# EAGLE design pcb_v2.2 (EAGLE 9.1.1)
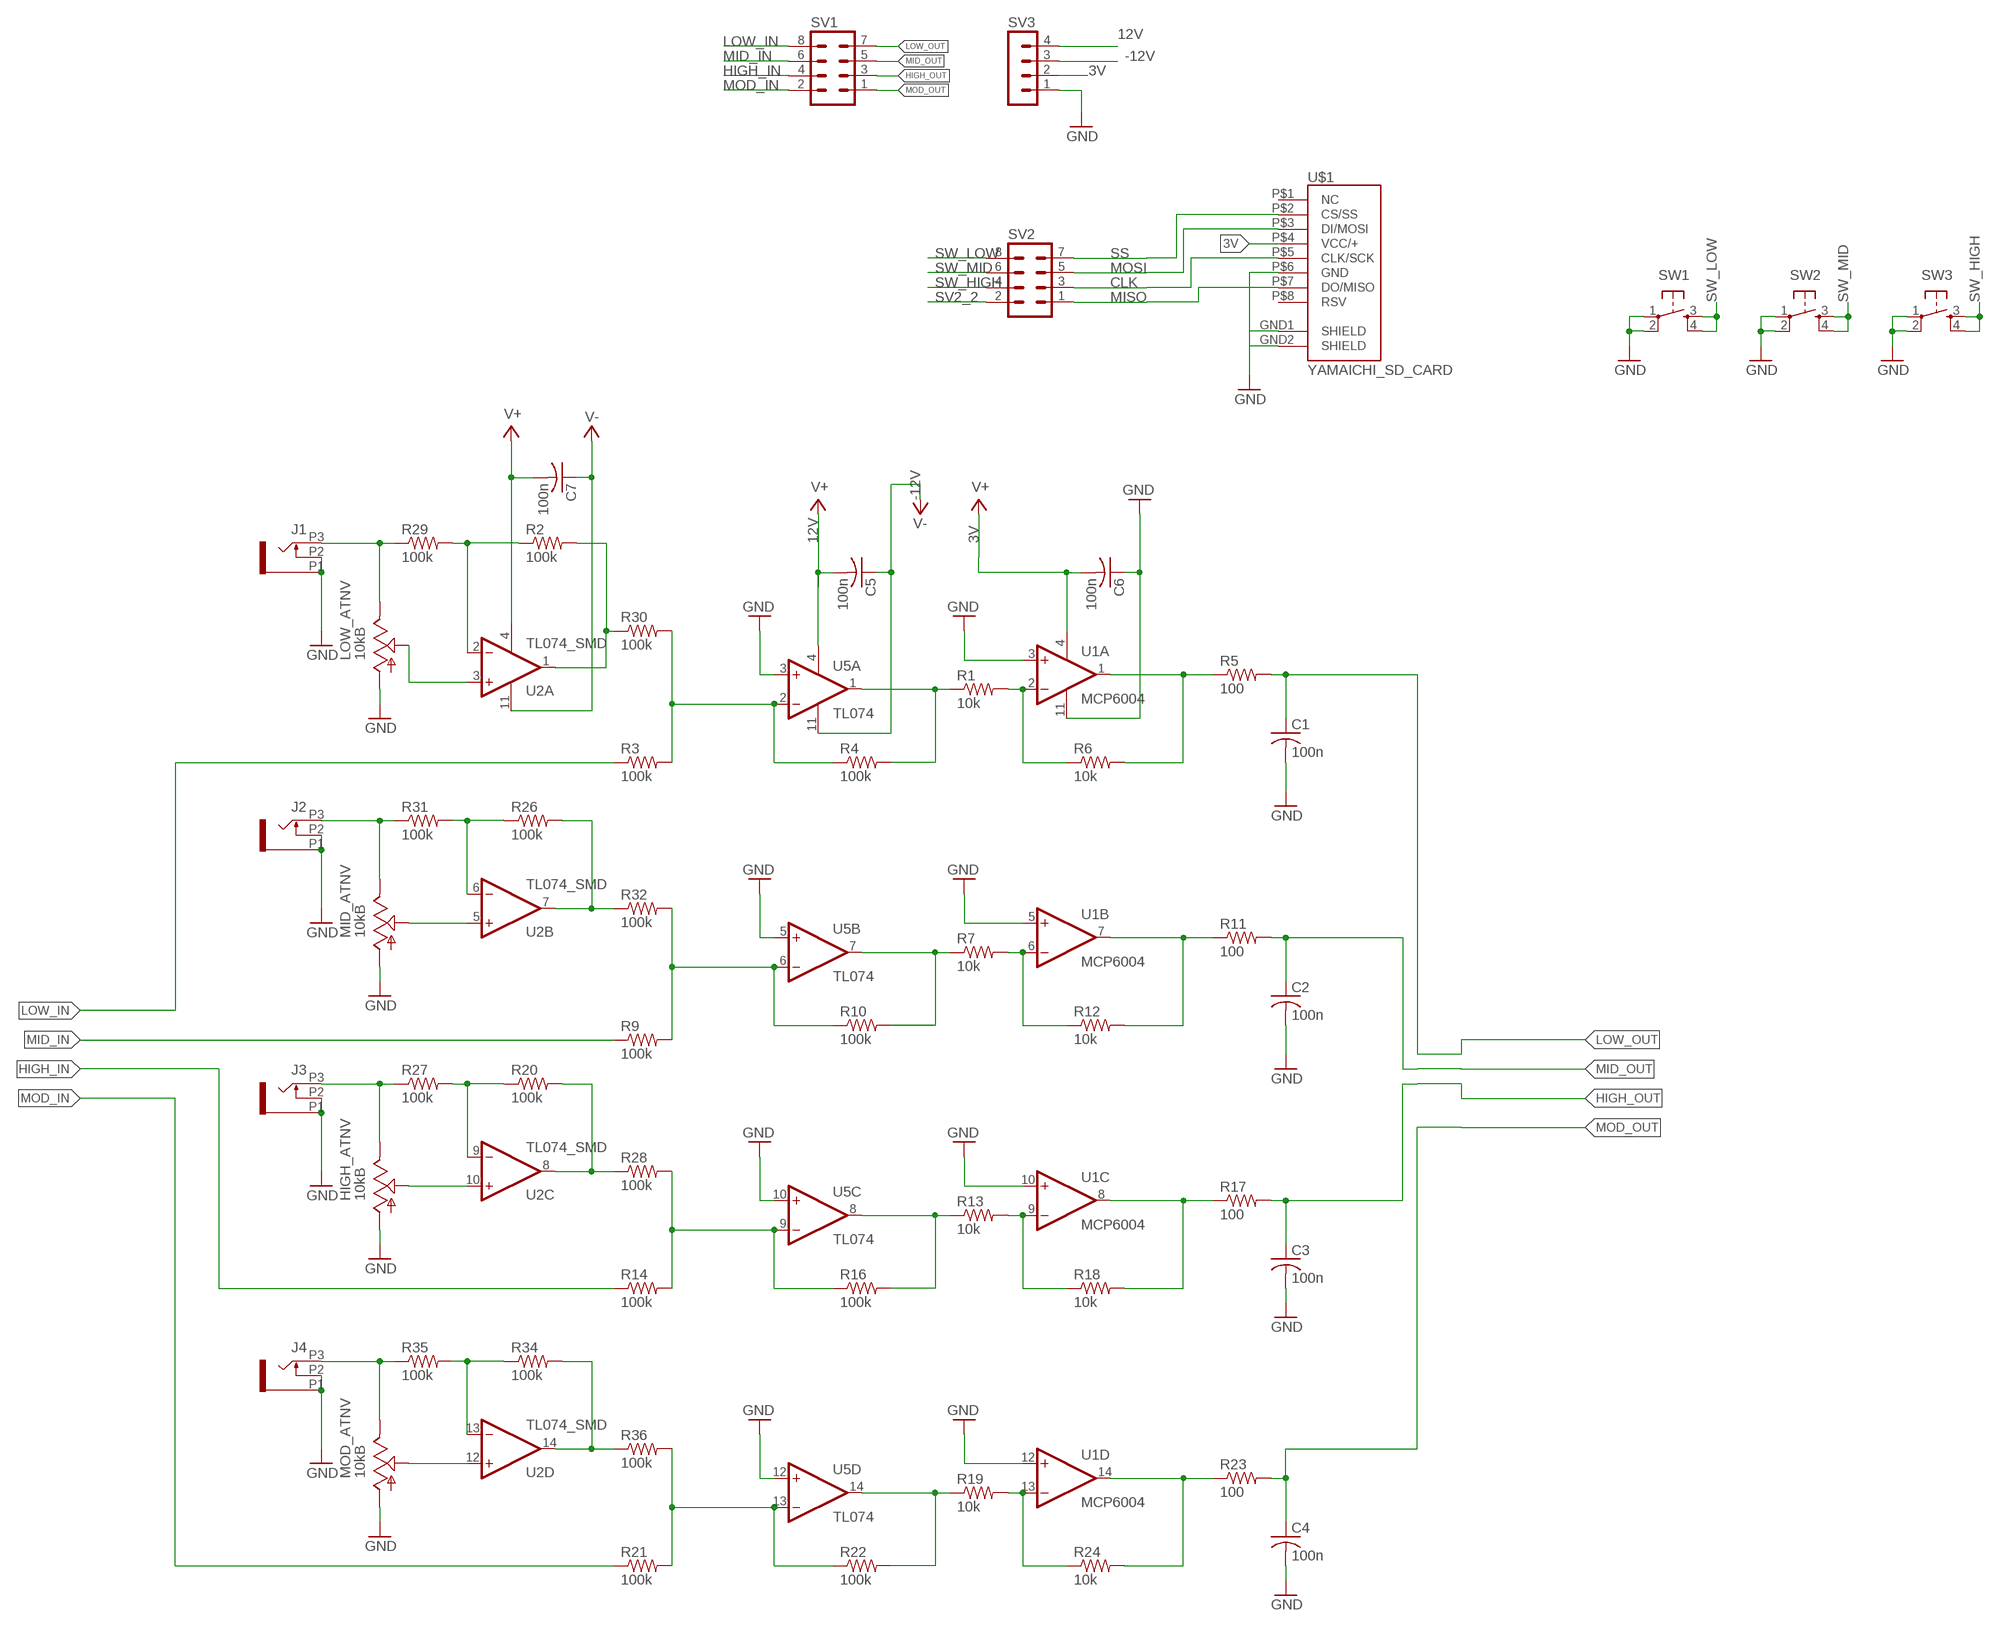
[diagram p0: schematic, sheet 1]

## Parts
C1  100n  C-USC0603  [C0603]
C2  100n  C-USC0603  [C0603]
C3  100n  C-USC0603  [C0603]
C4  100n  C-USC0603  [C0603]
C5  100n  C-USC0603  [C0603]
C6  100n  C-USC0603  [C0603]
C7  100n  C-USC0603  [C0603]
HIGH_ATNV  10kB  POT_USVERTICAL  [ALPS_POT_VERTICAL]
J1  PJ301_THONKICONN6  [WQP_PJ_301M6]
J2  PJ301_THONKICONN6  [WQP_PJ_301M6]
J3  PJ301_THONKICONN6  [WQP_PJ_301M6]
J4  PJ301_THONKICONN6  [WQP_PJ_301M6]
LOW_ATNV  10kB  POT_USVERTICAL  [ALPS_POT_VERTICAL]
MID_ATNV  10kB  POT_USVERTICAL  [ALPS_POT_VERTICAL]
MOD_ATNV  10kB  POT_USVERTICAL  [ALPS_POT_VERTICAL]
R1  10k  R-US_R0603  [R0603]
R2  100k  R-US_R0603  [R0603]
R3  100k  R-US_R0603  [R0603]
R4  100k  R-US_R0603  [R0603]
R5  100  R-US_R0603  [R0603]
R6  10k  R-US_R0603  [R0603]
R7  10k  R-US_R0603  [R0603]
R9  100k  R-US_R0603  [R0603]
R10  100k  R-US_R0603  [R0603]
R11  100  R-US_R0603  [R0603]
R12  10k  R-US_R0603  [R0603]
R13  10k  R-US_R0603  [R0603]
R14  100k  R-US_R0603  [R0603]
R16  100k  R-US_R0603  [R0603]
R17  100  R-US_R0603  [R0603]
R18  10k  R-US_R0603  [R0603]
R19  10k  R-US_R0603  [R0603]
R20  100k  R-US_R0603  [R0603]
R21  100k  R-US_R0603  [R0603]
R22  100k  R-US_R0603  [R0603]
R23  100  R-US_R0603  [R0603]
R24  10k  R-US_R0603  [R0603]
R26  100k  R-US_R0603  [R0603]
R27  100k  R-US_R0603  [R0603]
R28  100k  R-US_R0603  [R0603]
R29  100k  R-US_R0603  [R0603]
R30  100k  R-US_R0603  [R0603]
R31  100k  R-US_R0603  [R0603]
R32  100k  R-US_R0603  [R0603]
R34  100k  R-US_R0603  [R0603]
R35  100k  R-US_R0603  [R0603]
R36  100k  R-US_R0603  [R0603]
SV1  MA04-2  [MA04-2]
SV2  MA04-2  [MA04-2]
SV3  MA04-1  [MA04-1]
SW1  TAC_SWITCHPTH  [TACTILE-PTH]
SW2  TAC_SWITCHPTH  [TACTILE-PTH]
SW3  TAC_SWITCHPTH  [TACTILE-PTH]
U1  MCP6004  MCP6004_SMD  [SO14]
U2  TL074_SMD  [SO14]
U5  TL074  TL074_SMD  [SO14]
U$1  YAMAICHI_SD_CARD  [YAMAICHI_MICROSD_VERTICAL]

## Nets
3V: C6.2 SV3.2 U1.4(P:V+) ; supply symbol labelled V+
12V: C5.2 SV3.4 U5.4(P:V+) ; supply symbol labelled V+
-12V: C5.1 SV3.3 U5.11(P:V-) ; supply symbol labelled V-
CLK: SV2.3 U$1.P$5(CLK/SCK)
GND: C1.2 C2.2 C3.2 C4.2 C6.1 HIGH_ATNV.P$3(A) J1.P1 J1.P2 J2.P1 J2.P2 J3.P1 J3.P2 J4.P1 J4.P2 LOW_ATNV.P$3(A) MID_ATNV.P$3(A) MOD_ATNV.P$3(A) SV3.1 SW1.1 SW1.2 SW2.1 SW2.2 SW3.1 SW3.2 U1.3(A:+IN) U1.5(B:+IN) U1.10(C:+IN) U1.11(P:V-) U1.12(D:+IN) U5.3(A:+IN) U5.5(B:+IN) U5.10(C:+IN) U5.12(D:+IN) U$1.GND1(SHIELD) U$1.GND2(SHIELD) U$1.P$6(GND)
HIGH_IN: R14.1 SV1.4
HIGH_OUT: C3.1 R17.2 SV1.3
LOW_IN: R3.1 SV1.8
LOW_OUT: C1.1 R5.2 SV1.7
MID_IN: R9.1 SV1.6
MID_OUT: C2.1 R11.2 SV1.5
MISO: SV2.1 U$1.P$7(DO/MISO)
MOD_IN: R21.1 SV1.2
MOD_OUT: C4.1 R23.2 SV1.1
MOSI: SV2.5 U$1.P$3(DI/MOSI)
N$1: R2.1 R29.2 U2.2(A:-IN)
N$2: R26.1 R31.2 U2.6(B:-IN)
N$3: R2.2 R30.1 U2.1(A:OUT)
N$4: R1.1 R4.2 U5.1(A:OUT)
N$5: R5.1 R6.2 U1.1(A:OUT)
N$6: R20.1 R27.2 U2.9(C:-IN)
N$7: HIGH_ATNV.P$2(S) U2.10(C:+IN)
N$8: R9.2 R10.1 R32.2 U5.6(B:-IN)
N$9: R7.1 R10.2 U5.7(B:OUT)
N$10: LOW_ATNV.P$2(S) U2.3(A:+IN)
N$11: MID_ATNV.P$2(S) U2.5(B:+IN)
N$12: HIGH_ATNV.P$1(E) J3.P3 R27.1
N$13: R20.2 R28.1 U2.8(C:OUT)
N$14: R13.1 R16.2 U5.8(C:OUT)
N$15: R34.1 R35.2 U2.13(D:-IN)
N$16: U$1.P$4(VCC/+)
N$19: R19.1 R22.2 U5.14(D:OUT)
N$20: R1.2 R6.1 U1.2(A:-IN)
N$22: R7.2 R12.1 U1.6(B:-IN)
N$23: R13.2 R18.1 U1.9(C:-IN)
N$24: R19.2 R24.1 U1.13(D:-IN)
N$26: R11.1 R12.2 U1.7(B:OUT)
N$27: R17.1 R18.2 U1.8(C:OUT)
N$28: R23.1 R24.2 U1.14(D:OUT)
N$30: J1.P3 LOW_ATNV.P$1(E) R29.1
N$31: R3.2 R4.1 R30.2 U5.2(A:-IN)
N$32: J2.P3 MID_ATNV.P$1(E) R31.1
N$33: R26.2 R32.1 U2.7(B:OUT)
N$34: MOD_ATNV.P$2(S) U2.12(D:+IN)
N$35: J4.P3 MOD_ATNV.P$1(E) R35.1
N$36: R34.2 R36.1 U2.14(D:OUT)
N$37: R14.2 R16.1 R28.2 U5.9(C:-IN)
N$38: R21.2 R22.1 R36.2 U5.13(D:-IN)
SS: SV2.7 U$1.P$2(CS/SS)
SV2_2: SV2.2
SW_HIGH: SV2.4 SW3.3 SW3.4
SW_LOW: SV2.8 SW1.3 SW1.4
SW_MID: SV2.6 SW2.3 SW2.4
V+: C7.2 U2.4(P:V+)
V-: C7.1 U2.11(P:V-)
Unconnected: U$1.P$1(NC) U$1.P$8(RSV)

## Library data of the parts
C1-C7 = rcl:C-US: CAPACITOR, American symbol; SPICEPREFIX: C
HIGH_ATNV LOW_ATNV MID_ATNV MOD_ATNV = og-pots:POT_US
J1-J4 = og-pj301:PJ301_THONKICONN; SPICEPREFIX: J
R1-R7 R9-R14 R16-R24 R26-R32 R34-R36 = rcl:R-US_: RESISTOR, American symbol; SPICEPREFIX: R
SV1 SV2 = con-lstb:MA04-2: PIN HEADER; OC_FARNELL: unknown; OC_NEWARK: unknown
SV3 = con-lstb:MA04-1: PIN HEADER; OC_FARNELL: unknown; OC_NEWARK: unknown
SW1-SW3 = SparkFun:TAC_SWITCH: Momentary Switch Button commonly used for reset or general input. Spark Fun Electronics SKU : COM-00097
U1 = MusicThingModular:MCP6004: Generic Quad Op Amp
U2 U5 = MusicThingModular:TL074: Generic Quad Op Amp
U$1 = MusicThingModular:YAMAICHI_SD_CARD: Vertical SD Card Holder

## Board
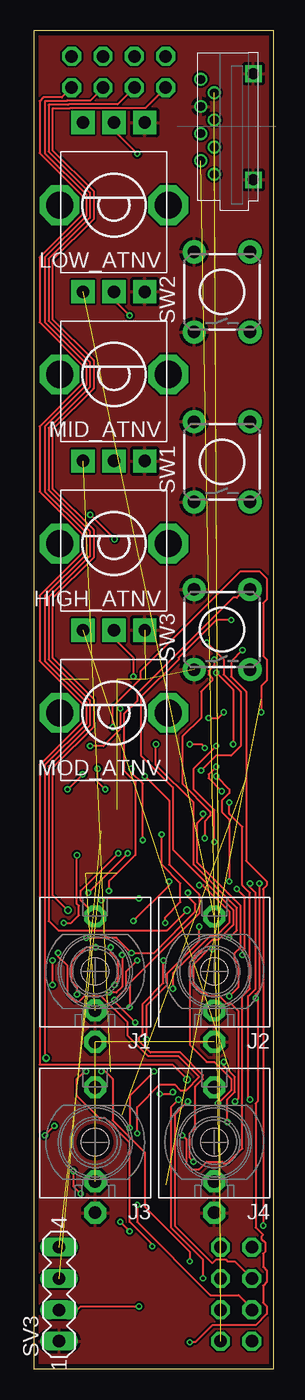
[diagram p1: board, top side]
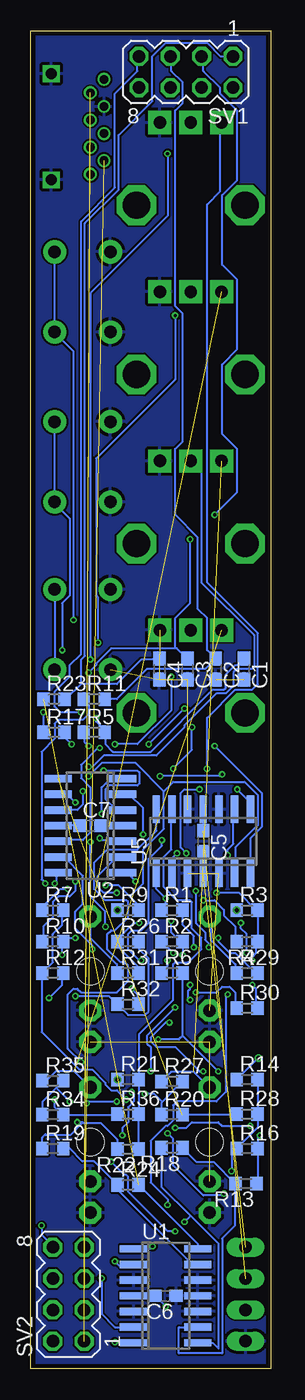
[diagram p2: board, bottom side, seen from below]

Size 19.43 x 108.43 mm. Coordinates in mm from the lower left corner, seen from the top.
Outline: 0,0 19.43,0 19.43,108.43 0,108.43 0,0
Copper layers (1*16): Top 0.035559375mm / dielectric 1.6mm / Bottom 0.035559375mm
Design rules "oshpark-2layer": minimum track width 6mil, minimum drill 10mil, track to track 6mil, track to pad 6mil, pad to pad 6mil, via to via 6mil, smd to smd 6mil, copper to edge 15mil, drill to drill 6mil, minimum pad ring 5mil, minimum via ring 5mil, stop-mask expansion 2.5mil, vias tented up to drill 0mil, thermal gap 10mil

### Footprints (pad centres in the part's own frame; a part is rotated, then mirrored left to right if it is on the bottom)
C0603 = smd 1.1 x 1: 1 -0.85,0; 2 0.85,0
ALPS_POT_VERTICAL = drill 1 pad 1.88 square: P$1 -2.5,6.7; P$2 0,6.7; P$3 2.5,6.7 | drill 2.2 pad 3.175 octagon: P$4 -4.4,0; P$5 4.4,0
WQP_PJ_301M6 = drill 1.016 pad 1.778 octagon: P1 0,-5.715; P2 0,-3.175; P3 0,4.445 | hole 2.2: 0,0
R0603 = smd 1 x 1.1: 1 -0.85,0; 2 0.85,0
MA04-2 = drill 1.016 octagon: 1 -3.81,-1.27; 2 -3.81,1.27; 3 -1.27,-1.27; 4 -1.27,1.27; 5 1.27,-1.27; 6 1.27,1.27; 7 3.81,-1.27; 8 3.81,1.27
MA04-1 = drill 1.016 long: 1 -3.81,0; 2 -1.27,0; 3 1.27,0; 4 3.81,0
TACTILE-PTH = drill 1.016 pad 1.88: 1 -3.251,2.261; 2 3.251,2.261; 3 -3.251,-2.261; 4 3.251,-2.261
SO14 = smd 0.6 x 2.2: 1 -3.81,-2.6; 2 -2.54,-2.6; 3 -1.27,-2.6; 4 0,-2.6; 5 1.27,-2.6; 6 2.54,-2.6; 7 3.81,-2.6; 8 3.81,2.6; 9 2.54,2.6; 10 1.27,2.6; 11 0,2.6; 12 -1.27,2.6; 13 -2.54,2.6; 14 -3.81,2.6
YAMAICHI_MICROSD_VERTICAL = drill 0.9 square: GND1 -4.3,-3.17; GND2 4.3,-3.17 | drill 0.7: P$1 -3.85,0; P$2 -2.75,1.1; P$3 -1.65,0; P$4 -0.55,1.1; P$5 0.55,0; P$6 1.65,1.1; P$7 2.75,0; P$8 3.85,1.1

### Placement (x,y rotation side)
C1  2.16,56.71 270 bottom
C2  4.45,56.71 270 bottom
C3  6.73,56.71 270 bottom
C4  9.02,56.71 270 bottom
C5  5.46,42.74 270 bottom
C6  8.51,5.91 180 bottom
C7  14.61,44.01 0 bottom
HIGH_ATNV  6.48,66.87 0 top
J1  4.95,32.19 0 top
J2  14.61,32.19 0 top
J3  4.95,18.35 0 top
J4  14.61,18.35 0 top
LOW_ATNV  6.48,94.3 0 top
MID_ATNV  6.48,80.58 0 top
MOD_ATNV  6.48,53.15 0 top
R1  8,37.15 0 bottom
R2  8,34.61 0 bottom
R3  1.91,37.15 0 bottom
R4  1.91,34.61 180 bottom
R5  14.3,51.57 0 bottom
R6  8,32.07 0 bottom
R7  17.65,37.15 0 bottom
R9  11.56,37.15 0 bottom
R10  17.65,34.61 0 bottom
R11  14.3,54.27 0 bottom
R12  17.65,32.07 0 bottom
R13  2.01,15 180 bottom
R14  1.91,23.43 0 bottom
R16  1.91,17.84 0 bottom
R17  17.55,51.57 0 bottom
R18  8,17.89 180 bottom
R19  17.65,17.84 0 bottom
R20  8,20.59 0 bottom
R21  11.56,23.43 0 bottom
R22  11.56,17.79 180 bottom
R23  17.55,54.27 0 bottom
R24  11.56,14.9 0 bottom
R26  11.56,34.61 0 bottom
R27  8,23.28 0 bottom
R28  1.91,20.64 0 bottom
R29  1.91,32.07 0 bottom
R30  1.91,29.22 0 bottom
R31  11.56,32.07 0 bottom
R32  11.56,29.53 0 bottom
R34  17.65,20.59 0 bottom
R35  17.65,23.33 0 bottom
R36  11.56,20.64 0 bottom
SV1  6.86,105.09 180 bottom
SV2  16.38,6.03 90 bottom
SV3  2.03,6.03 90 top
SW1  15.24,73.49 90 top
SW2  15.24,87.26 90 top
SW3  15.24,59.91 90 top
U1  8.51,5.91 270 bottom
U2  14.61,44.01 90 bottom
U5  5.46,42.74 0 bottom
U$1  14.61,100.65 90 top

### Tracks (layer width: path | path; a pad name or v marks a point on that pad's centre or on a via)
3V  (via drill 0.25)
  Top 0.152: v8.51,5.04 3.79,5.04 3.48,4.74 2.11,4.74 SV3.2
  Bottom 0.152: U1.4 11.1,5.96 9.42,5.96 C6.2 9.27,5.8 v8.51,5.04
12V  (1 unrouted)
  Bottom 0.152: C5.2 5.46,41.77 5.46,40.25 U5.4
-12V  (1 unrouted)
  Bottom 0.152: C5.1 5.46,43.6 5.46,45.28 U5.11
CLK  (1 unrouted)
GND  (9 unrouted)
  pour Bottom: 0.38,108.52 19.68,108.52 19.68,-0.7 0.38,-0.7
  pour Top: -0.64,109.03 20.19,109.03 20.19,-0.7 19.68,-1.21 0.38,-1.21 -0.64,-0.19
HIGH_IN  (via drill 0.35)
  Top 0.152: SV1.4 4.54,102.78 2.69,102.78 2.64,102.73 0.89,102.73 0.89,98.51 4.22,95.18 4.22,93.41 0.89,90.08 0.89,84.8 4.22,81.47 4.22,79.69 0.89,76.37 0.89,71.08 4.22,67.75 4.22,65.98 0.89,62.65 0.89,57.37 4.22,54.04 4.22,52.26 0.97,49.01 0.89,48.93 0.89,26.53 | 0.89,26.53 | 0.89,26.53 0.89,25.28 v0.99,25.18
  Bottom 0.152: v0.99,25.18 2.74,23.43 R14.1
HIGH_OUT  (via drill 0.25)
  Top 0.152: v16.13,50.61 16.13,55.03 v14.76,56.4 | v6.53,67.22 v4.55,69.2
  Bottom 0.152: v16.13,50.61 16.59,51.07 16.59,51.52 R17.2 | v14.76,56.4 14.15,57.01 14.15,57.16 12.93,58.38 7.75,58.38 | 7.75,58.38 7.6,58.38 6.83,57.62 C3.1 | v4.55,69.2 2.72,71.03 2.72,74.54 3.94,75.76 3.94,81.39 2.72,82.61 2.72,88.25 3.94,89.47 3.94,95.11 2.72,96.33 2.72,101.97 4.09,103.34 4.09,103.8 5.46,105.17 5.46,106.24 SV1.3 | v6.53,67.22 6.53,62.04 7.75,60.82 7.75,58.38
LOW_IN  (via drill 0.35)
  Top 0.152: SV1.8 9.01,102.17 2.94,102.17 2.9,102.12 1.5,102.12 1.5,98.77 4.83,95.44 4.83,93.16 1.5,89.83 1.5,85.05 4.83,81.72 4.83,79.44 1.5,76.11 1.5,71.33 4.83,68.01 4.83,65.73 1.5,62.4 1.5,57.62 4.83,54.29 4.83,52.01 1.7,48.88 1.5,48.68 1.5,38.4 R3.1
  other vias: 2.75,37.15
LOW_OUT  (via drill 0.25)
  Top 0.152: v15.37,53.2 14.91,52.74 v14.15,52.74
  Bottom 0.152: C1.1 2.26,57.47 2.72,57.01 2.87,57.01 3.63,56.25 3.63,55.18 3.79,55.03 4.7,55.03 9.73,50 12.78,50 13.39,50.61 13.39,51.52 R5.2 13.39,51.68 14.15,52.44 v14.15,52.74 | v15.37,53.2 17.04,53.2 17.5,53.66 17.5,54.88 16.28,56.1 16.28,57.01 15.37,57.92 15.37,92.98 12.62,95.72 12.62,103.34 10.79,105.17 10.79,106.24 SV1.7
MID_IN  (via drill 0.35)
  Top 0.152: SV1.6 6.78,102.47 2.82,102.47 2.77,102.43 1.19,102.43 1.19,98.64 4.52,95.31 4.52,93.28 1.19,89.95 1.19,84.92 4.52,81.59 4.52,79.57 1.19,76.24 1.19,71.21 4.52,67.88 4.52,65.85 1.19,62.52 1.19,57.49 4.52,54.16 4.52,52.14 1.19,48.81 1.19,36.28 1.96,35.52 10.78,35.52 R9.1
  other vias: 12.41,37.15
MID_OUT
  Bottom 0.152: R11.2 13.39,54.27 12.47,54.27 10.03,56.71 5.31,56.71 4.55,57.47 C2.1 4.55,57.62 5.16,58.23 5.16,60.82 5.92,61.58 5.92,67.37 7.75,69.2 7.75,74.54 7.14,75.15 7.14,85.51 7.75,86.12 7.75,101.97 7.14,102.58 7.14,104.25 8.05,105.17 8.05,106.24 SV1.5
MISO  (1 unrouted)
MOD_IN  (via drill 0.35)
  Top 0.152: SV1.2 2.26,103.04 0.76,103.04 0.46,102.73 0.46,98.51 3.91,95.06 3.91,93.54 0.46,90.08 0.46,84.8 3.91,81.34 3.91,79.82 0.46,76.36 0.46,71.08 3.91,67.63 3.91,66.1 0.46,62.65 0.46,57.37 3.91,53.91 3.91,52.39 0.46,48.93 0.46,24.65 11.19,24.65 R21.1
  other vias: 12.41,23.43
MOD_OUT
  Bottom 0.152: 15.37,55.49 16.59,54.27 R23.2 | 15.37,55.49 12.47,55.49 10.49,57.47 9.12,57.47 C4.1 | 15.37,55.49 15.37,57.47 15.06,57.77 15.06,92.82 12.32,95.57 12.32,99.99 9.58,102.73 9.58,106.39 8.51,107.45 5.16,107.45 4.09,106.39 3.17,106.39 SV1.1
MOSI  (1 unrouted)
N$1  (via drill 0.25)
  Top 0.152: v4.24,34.91 6.68,34.91 v7.9,33.69 9.73,33.69 13.08,37.05 13.08,37.66 12.47,38.27 v12.47,38.57
  Bottom 0.152: v4.24,34.91 4.24,34.61 3.33,33.69 2.87,33.69 1.65,32.47 1.5,32.47 1.19,32.17 R29.2 | v7.9,33.69 8.81,34.61 R2.1 | v12.47,38.57 13.54,38.57 14,39.03 14,39.94 12.47,41.47 U2.2
N$2  (via drill 0.25)
  Top 0.152: v10.34,43.29 10.34,40.86 11.86,39.33 11.86,37.81 10.64,36.59 v10.64,36.13
  Bottom 0.152: 12.32,34.61 12.32,34.15 10.79,32.63 10.79,32.17 R31.2 | 12.32,34.61 R26.1 12.32,34.61 | v10.34,43.29 10.34,45.43 11.4,46.49 11.86,46.49 U2.6 | v10.64,36.13 11.1,36.13 12.32,34.91 12.32,34.61
N$3  (via drill 0.25)
  Top 0.152: v6.07,30.49 6.68,30.49 7.14,30.95 v7.14,33.54 | v10.95,39.48 10.95,39.18 v8.05,36.28
  Bottom 0.152: v6.07,30.49 4.39,30.49 3.94,30.95 3.33,30.95 2.87,30.49 2.87,29.27 R30.1 | v7.14,33.54 7.14,34.61 R2.2 7.29,34.61 8.05,35.37 v8.05,36.28 | v10.95,39.48 11.56,40.09 11.86,40.09 U2.1
N$4  (via drill 0.25)
  Top 0.152: v5.46,37.96 5.61,38.11 v8.51,38.11
  Bottom 0.152: v5.46,37.96 4.55,37.96 3.79,37.2 3.79,36.74 2.87,35.83 2.87,34.61 R4.2 | R1.1 8.81,37.2 8.51,37.5 v8.51,38.11 9.27,38.87 9.27,40.09 U5.1
N$5  (via drill 0.25)
  Top 0.152: v4.24,24.09 4.09,23.94 3.94,23.94 3.48,23.48 3.48,22.11 5.31,20.28 5.77,20.28 7.75,18.3 7.75,11.9 9.58,10.07 v9.58,9.92 | v14.76,50.46 12.93,48.63 12.93,46.95 14.61,45.28 v14.61,42.68 | v13.39,35.83 13.39,34.61 10.79,32.02 10.79,31.1 9.12,29.43 v9.12,26.68
  Bottom 0.152: 7.14,26.99 7.14,32.02 R6.2 | v4.24,24.09 7.14,26.99 | v9.58,9.92 9.73,9.77 11.1,9.77 U1.1 | v14.76,50.46 15.06,50.76 15.06,51.52 R5.1 | v14.61,42.68 14.61,38.27 13.39,37.05 v13.39,35.83 | v9.12,26.68 7.44,26.68 7.14,26.99
N$6  (via drill 0.25)
  Top 0.152: v15.82,45.89 15.82,44.97 16.89,43.9 16.89,39.18 17.5,38.57 17.5,30.8 16.89,30.19 16.89,17.84 15.67,16.62 15.37,16.62 15.21,16.78 14,16.78 13.39,16.17 12.78,16.17 12.32,16.62 12.32,18.61 v12.01,18.91 | v11.25,22.42 11.1,22.26 v10.19,22.26
  Bottom 0.152: R27.2 8.79,21.63 | 8.79,21.63 8.85,21.58 R20.1 | v15.82,45.89 16.43,46.49 17.2,46.49 U2.9 | v12.01,18.91 12.01,19.52 11.56,19.98 11.56,21.2 11.1,21.65 11.1,22.26 v11.25,22.42 | v10.19,22.26 9.42,22.26 8.81,21.65 8.79,21.63
N$7  (via drill 0.25)
  Top 0.152: v15.21,46.8 14.15,47.87 14.15,48.17 v14.76,48.78
  Bottom 0.152: v15.21,46.8 15.21,45.73 15.67,45.28 U2.10 | v14.76,48.78 14.45,48.78 13.54,49.7 9.27,49.7 6.99,51.98 6.99,52.13 4.39,54.72 3.63,54.72 3.02,55.33 3.02,56.4 2.72,56.71 1.5,56.71 1.35,56.86 1.35,59.45 5.61,63.72 5.61,72.71 6.38,73.47 HIGH_ATNV.P$2
N$8  (via drill 0.25)
  Top 0.152: v11.25,30.8 11.25,32.02 14.3,35.06 14.76,35.06 15.82,36.13 15.82,37.05 13.69,39.18 v13.39,39.18 | v15.82,39.48 15.82,44.51 15.21,45.12 15.21,46.04 15.82,46.65 15.82,46.95 v14.76,48.02
  Bottom 0.152: v11.25,30.8 10.79,30.34 10.79,29.58 R32.2 | v13.39,39.18 12.32,39.18 11.4,38.27 | 11.4,38.27 10.79,37.66 10.79,37.2 R9.2 | v15.82,39.48 15.82,38.72 16.28,38.27 17.2,38.27 17.65,37.81 17.65,36.59 18.41,35.83 18.41,34.61 R10.1 | v14.76,48.02 13.69,49.09 10.95,49.09 8.66,46.8 | 8.66,46.8 8.66,43.75 10.34,42.08 10.34,39.33 11.4,38.27 | 8.66,46.8 7.9,47.56 2.11,47.56 1.04,46.49 1.04,44.06 2.87,42.23 2.87,40.25 U5.6
N$9  (via drill 0.25)
  Top 0.152: v16.89,33.54 16.89,33.85 17.04,34 17.04,38.27 v16.43,38.87 | v4.55,50.46 5.61,50.46 6.99,51.83 v6.99,53.51 | v9.88,50.61 9.88,48.93 12.93,45.89 12.93,40.86 16.43,37.35 16.43,35.52 v15.82,34.91
  Bottom 0.152: v16.89,33.54 16.89,34.61 R10.2 16.74,34.61 16.43,34.91 v15.82,34.91 | v16.43,38.87 17.04,38.87 18.41,37.5 18.41,37.2 R7.1 | v4.55,50.46 0.74,46.65 0.74,43.9 1.65,42.99 1.65,40.25 U5.7 | v9.88,50.61 v6.99,53.51
N$10  (via drill 0.25)
  Top 0.152: v13.84,42.99 13.84,44.36 14.3,44.82 14.3,45.12 12.01,47.41 12.01,51.22 13.54,52.74 13.54,54.88 14.45,55.79 14.45,55.94 14.15,56.25 14.15,56.55 14.61,57.01 v14.61,57.47 | v8.36,98.46 6.53,100.29 6.53,100.9 LOW_ATNV.P$2
  Bottom 0.152: v13.84,42.99 13.69,42.84 12.01,42.84 U2.3 | v14.61,57.47 14.61,87.19 8.36,93.43 v8.36,98.46
N$11  (via drill 0.25)
  Top 0.152: v13.54,48.48 14.76,49.7 15.98,49.7 16.74,50.46 16.74,54.88 15.37,56.25 15.37,57.47 v14,58.84 | v7.75,85.36 6.53,86.58 6.53,87.19 MID_ATNV.P$2
  Bottom 0.152: v13.54,48.48 10.79,48.48 10.64,48.32 10.64,47.41 10.79,47.26 13.08,47.26 13.39,46.95 13.39,46.19 12.47,45.28 U2.5 | v14,58.84 14,62.5 14.15,62.65 14.15,73.77 7.75,80.18 v7.75,85.36
N$12  (1 unrouted)
  Bottom 0.152: J3.P3 6.21,24.06 8.07,24.06 R27.1
N$13  (1 unrouted)
  Bottom 0.152: R28.1 2.81,20.59 R20.2
N$14  (via drill 0.25)
  Top 0.152: v1.65,19.67 v0.89,18.91 | v7.75,19.52 7.75,22.11 v9.73,24.09 | v7.75,29.27 7.75,31.25 13.39,36.89 13.39,38.42 10.95,40.86 10.95,46.04 v8.97,48.02 | v2.72,46.95 v3.94,48.17
  Bottom 0.152: R13.1 1.05,15.1 R16.2 1.04,17.84 1.04,18.76 v0.89,18.91 | v1.65,19.67 3.94,19.67 4.24,19.98 6.38,19.98 6.83,19.52 v7.75,19.52 | v9.73,24.09 9.73,26.07 10.03,26.38 10.03,26.99 v7.75,29.27 | v8.97,48.02 4.09,48.02 v3.94,48.17 | v2.72,46.95 1.65,45.89 1.65,45.43 U5.8
N$15  (via drill 0.25)
  Top 0.152: v14.45,34 14.3,34.15 12.93,32.78 12.93,31.1 13.54,30.49 13.84,30.49 14.15,30.19 15.06,30.19 15.67,29.58 15.98,29.58 16.59,28.97 16.59,21.96 v16.28,21.65
  Bottom 0.152: R35.2 17.38,22.75 | 17.38,22.75 18.5,21.63 R34.1 | v14.45,34 14.45,34.3 15.82,35.67 15.82,37.05 15.21,37.66 15.21,39.94 16.74,41.47 U2.13 | v16.28,21.65 17.35,22.72 17.38,22.75
N$19  (via drill 0.25)
  Top 0.152: v15.37,24.85 15.37,24.55 16.28,23.63 16.28,22.42 15.67,21.81 v15.67,19.98
  Bottom 0.152: 18.3,18.94 18.5,18.74 R19.1 | 18.3,18.94 18.24,18.99 | R22.2 12.44,17.82 12.44,18.57 13.78,19.91 15.21,19.91 | 18.3,18.94 16.21,18.94 15.25,19.91 15.21,19.91 | v15.37,24.85 16.43,25.92 16.43,30.34 15.98,30.8 15.67,30.8 15.37,30.49 12.47,30.49 11.56,31.41 11.56,32.63 11.86,32.93 12.17,32.93 13.23,34 13.23,35.22 12.93,35.52 12.62,35.52 11.56,36.59 11.56,37.81 11.71,37.96 13.39,37.96 14.3,38.87 14.3,41.01 13.23,42.08 10.79,42.08 9.27,43.6 9.27,45.28 U5.14 | v15.67,19.98 15.21,19.98 15.21,19.91
N$20  (via drill 0.25)
  Top 0.152: v6.22,34.15 6.22,33.69 6.83,33.08 6.83,31.41 v6.53,31.1 | v8.36,33.08 7.44,32.17 7.44,30.8 v6.53,29.88 6.53,29.73 v8.2,28.05 | v12.62,8.7 12.62,9.46 8.97,13.12 8.97,17.54 6.38,20.13 6.38,23.48 5.61,24.24 v5.46,24.09
  Bottom 0.152: v6.22,34.15 6.22,35.06 7.14,35.98 7.14,37.05 R1.2 | v6.53,31.1 6.53,30.8 6.68,30.65 6.68,30.04 v6.53,29.88 | v8.36,33.08 8.36,32.63 8.81,32.17 R6.1 | v12.62,8.7 12.32,8.39 11.25,8.39 U1.2 | v5.46,24.09 5.77,24.09 7.75,26.07 9.27,26.07 9.73,26.53 9.73,26.84 8.51,28.05 v8.2,28.05
N$22  (via drill 0.25)
  Top 0.152: v13.69,7.33 13.69,8.85 11.1,11.44 11.1,21.2 v11.71,21.81
  Bottom 0.152: R7.2 16.89,37.05 16.89,35.98 17.65,35.22 17.65,32.93 18.41,32.17 R12.1 18.57,32.02 18.57,27.29 15.52,24.24 14.45,24.24 13.39,23.18 13.39,23.03 12.93,22.57 12.47,22.57 v11.71,21.81 | v13.69,7.33 13.69,4.43 12.62,3.37 11.25,3.37 U1.6
N$23
  Bottom 0.152: R18.1 6.02,16.76 4.62,16.76 R13.2 2.92,14.93 2.92,11.56 3.94,10.55 3.94,1.23 7.43,1.23 7.43,3.37 U1.9
N$24
  Bottom 0.152: R19.2 16.3,17.84 15.25,16.79 14.3,16.79 R24.1 12.41,14.49 6.36,8.45 U1.13
N$26  (via drill 0.25)
  Top 0.152: v18.26,39.33 18.26,30.65 17.96,30.34 v17.96,30.04 18.11,29.88 18.11,21.65 17.96,21.5 17.96,11.44 18.57,10.83 18.41,10.68 18.41,10.53 18.72,10.22 18.72,9.46 18.57,9.31 18.57,8.24 18.87,7.94 18.87,7.02 18.57,6.72 18.57,5.35 18.87,5.04 18.87,4.43 17.96,3.52 14.45,3.52 13.08,2.15 v12.62,2.15
  Bottom 0.152: v17.96,30.04 16.89,31.1 16.89,32.02 R12.2 | v18.26,39.33 18.57,39.64 18.57,50 17.5,51.07 17.5,52.29 17.2,52.59 15.21,52.59 14.76,53.05 14.76,53.81 15.06,54.11 R11.1 | v12.62,2.15 11.25,2.15 U1.7
N$27  (via drill 0.25)
  Top 0.152: v18.41,53.2 18.41,55.33 18.87,55.79 18.87,57.47 18.57,57.77 18.57,62.04 18.87,62.34 18.87,64.02 18.26,64.63 16.74,64.63 8.66,56.55 8.66,55.94 6.38,53.66 v6.38,51.98 | v7.9,48.63 7.9,48.32 8.81,47.41 v8.81,42.84 | v10.49,33.08 10.49,31.25 8.81,29.58 8.81,27.14 8.51,26.84 8.51,26.53 9.42,25.62 11.86,25.62 13.69,23.79 13.69,23.48 13.08,22.87 13.08,19.52 12.62,19.06 12.62,17.08 v12.93,16.78 | v6.99,11.9 v7.75,11.14
  Bottom 0.152: 6.49,12.39 8.85,14.75 R18.2 | 6.49,12.39 4.24,10.14 4.24,1.65 4.69,2.1 U1.8 | v18.41,53.2 18.41,51.68 R17.1 | v6.38,51.98 6.38,50.15 v7.9,48.63 | v8.81,42.84 8.81,42.38 9.88,41.31 9.88,36.13 10.49,35.52 11.25,35.52 11.56,35.22 11.56,34 10.64,33.08 v10.49,33.08 | v12.93,16.78 11.86,15.71 11.71,15.71 11.56,15.56 11.56,14.34 8.36,11.14 v7.75,11.14 | v6.99,11.9 6.53,12.36 6.49,12.39
N$28  (1 unrouted)
  Bottom 0.152: R24.2 5.91,10.1 U1.14
N$30  (via drill 0.25)
  Top 0.152: v5.16,48.63 5.16,47.56 v5.77,46.95 | v6.83,41.77 3.79,38.72 3.79,37.96 5,36.74 J1.P3
  Bottom 0.152: R29.1 2.87,32.17 2.87,32.78 4.85,34.76 4.85,36.59 J1.P3 | v5.16,48.63 5.16,52.74 2.87,55.03 1.5,55.03 1.04,55.49 1.04,59.6 5.16,63.72 5.16,94.35 4.09,95.42 4.09,100.9 LOW_ATNV.P$1 | v5.77,46.95 6.99,46.95 7.29,46.65 7.29,42.23 v6.83,41.77
N$31  (via drill 0.25)
  Top 0.152: v1.5,33.08 v1.5,31.1 | v4.39,38.57 v7.6,41.77
  Bottom 0.152: v1.5,31.1 1.19,30.8 1.19,29.27 R30.2 | v1.5,33.08 1.5,33.39 1.19,33.69 1.19,34.61 R4.1 R3.2 1.19,37.2 2.57,38.57 v4.39,38.57 | v7.6,41.77 7.9,41.47 7.9,40.25 U5.2
N$32  (1 unrouted)
  Bottom 0.152: R31.1 12.47,32.17 12.47,32.78 14.61,34.91 14.61,36.59 J2.P3
N$33  (via drill 0.25)
  Top 0.152: v13.69,44.97 13.69,44.67 13.23,44.21 13.23,41.01 16.74,37.5 16.74,34.15 16.28,33.69 16.28,33.08 16.59,32.78 16.59,30.95 v15.82,30.19
  Bottom 0.152: R26.2 10.64,34.61 10.64,34 9.88,33.24 9.88,28.97 10.19,28.66 11.56,28.66 12.32,29.43 R32.1 12.47,29.58 13.08,30.19 v15.82,30.19 | v13.69,44.97 13.69,47.1 13.08,47.71 12.01,47.71 U2.7
N$34  (via drill 0.25)
  Top 0.152: v13.84,50.3 13.54,50.61 v12.62,50.61 | v8.05,56.1 8.05,57.62 6.53,59.14 6.53,59.75 MOD_ATNV.P$2
  Bottom 0.152: v13.84,50.3 14,50.3 15.37,48.93 15.37,47.87 14.61,47.1 14.61,43.45 15.21,42.84 17.2,42.84 U2.12 | v12.62,50.61 10.79,50.61 8.05,53.35 v8.05,56.1
N$35  (1 unrouted)
  Bottom 0.152: R35.1 18.18,23.33 17.4,24.11 15.92,24.11 J4.P3
N$36  (via drill 0.25)
  Top 0.152: v17.5,39.33 17.5,39.03 17.96,38.57 17.96,30.8 17.35,30.19 17.35,21.96 v17.5,21.81
  Bottom 0.152: R36.1 12.46,20.59 R34.2 16.89,20.59 17.5,21.2 v17.5,21.81 | v17.5,39.33 17.35,39.48 17.35,40.09 U2.14
N$37  (via drill 0.25)
  Top 0.152: v3.48,41.62 3.48,37.66 3.63,37.5 3.63,36.74 3.02,36.13 v2.41,36.13 | v1.96,33.69 1.96,33.39 2.72,32.63 2.72,30.34 3.33,29.73 3.63,29.73 4.09,30.19 5.46,30.19 7.6,28.05 7.6,26.99 9.27,25.31 11.71,25.31 13.39,23.63 12.32,22.57 11.86,22.57 11.4,23.03 10.19,23.03 8.36,21.2 v8.36,19.06 | v3.79,14.19 3.17,14.8 v3.17,16.01
  Bottom 0.152: R14.2 R28.2 1.05,19.54 R16.1 2.87,17.84 3.17,17.54 v3.17,16.01 | v3.48,41.62 3.48,42.08 3.02,42.53 3.02,45.28 U5.9 | v2.41,36.13 2.41,35.67 1.96,35.22 v1.96,33.69 | v8.36,19.06 7.9,18.61 7.9,16.47 5.46,14.03 3.94,14.03 v3.79,14.19
N$38
  Bottom 0.152: R22.1 R36.2 R21.2 10.64,23.48 10.64,27.14 7.9,29.88 7.9,32.78 7.75,32.93 6.68,32.93 5.61,34 5.61,34.91 6.38,35.67 6.38,37.81 6.53,37.96 7.6,37.96 8.66,39.03 8.66,41.47 8.05,42.08 8.05,45.28 U5.13
SS  (1 unrouted)
SW_HIGH  (via drill 0.25)
  Top 0.152: v8.36,13.27 8.36,11.9 14.3,5.96 16.59,5.96 17.65,4.89 SV2.4 | v3.48,30.34 3.48,30.95 3.02,31.41 3.02,32.93 4.24,34.15 v5,34.15 | v6.07,38.72 6.07,39.48 8.2,41.62 8.2,47.56 7.29,48.48 7.29,53.05 8.36,54.11 8.36,54.72 16.13,62.5 16.43,62.5 17.04,63.11 17.5,63.11 SW3.4
  Bottom 0.152: v8.36,13.27 8.36,13.73 9.73,15.1 9.73,18.45 8.51,19.67 8.36,19.67 7.9,20.13 7.9,21.35 7.6,21.65 4.39,21.65 3.63,22.42 3.63,30.19 v3.48,30.34 | v5,34.15 5,34.46 5.31,34.76 5.31,35.37 6.07,36.13 v6.07,38.72 | SW3.3 17.5,56.71 17.5,63.11 SW3.4
SW_LOW  (via drill 0.25)
  Top 0.152: v18.57,11.6 18.57,38.87 18.87,39.18 18.87,39.48 17.2,41.16 17.2,54.88 15.98,56.1 15.98,57.32 v16.89,58.23
  Bottom 0.152: v18.57,11.6 18.57,10.83 17.65,9.92 SV2.8 | v16.89,58.23 16.89,62.04 16.28,62.65 16.28,68.9 17.5,70.12 SW1.3 17.5,70.27 17.5,76.67 SW1.4
SW_MID  (via drill 0.25)
  Top 0.152: v12.47,21.65 11.4,20.59 11.4,11.6 14.45,8.55 14.76,8.85 15.52,8.85 15.67,8.7 16.28,8.7 17.65,7.33 SV2.6 | v14.91,21.5 15.98,22.57 15.98,23.48 14.61,24.85 14,24.85 12.62,26.23 12.62,32.93 14.45,34.76 14.91,34.76 16.13,35.98 16.13,37.2 11.25,42.08 11.25,47.1 8.66,49.7 8.66,54.42 11.71,57.47 11.71,57.62 14.76,60.67 v15.98,60.67
  Bottom 0.152: v12.47,21.65 14.76,21.65 v14.91,21.5 | v15.98,60.67 15.98,82.46 17.5,83.99 SW2.3 17.5,84.14 17.5,90.39 SW2.4
V+
  Bottom 0.152: C7.2 13.69,44.06 12.01,44.06 U2.4
V-
  Bottom 0.152: C7.1 15.52,44.06 17.2,44.06 U2.11